# EAGLE design interface (EAGLE 9.6.2)
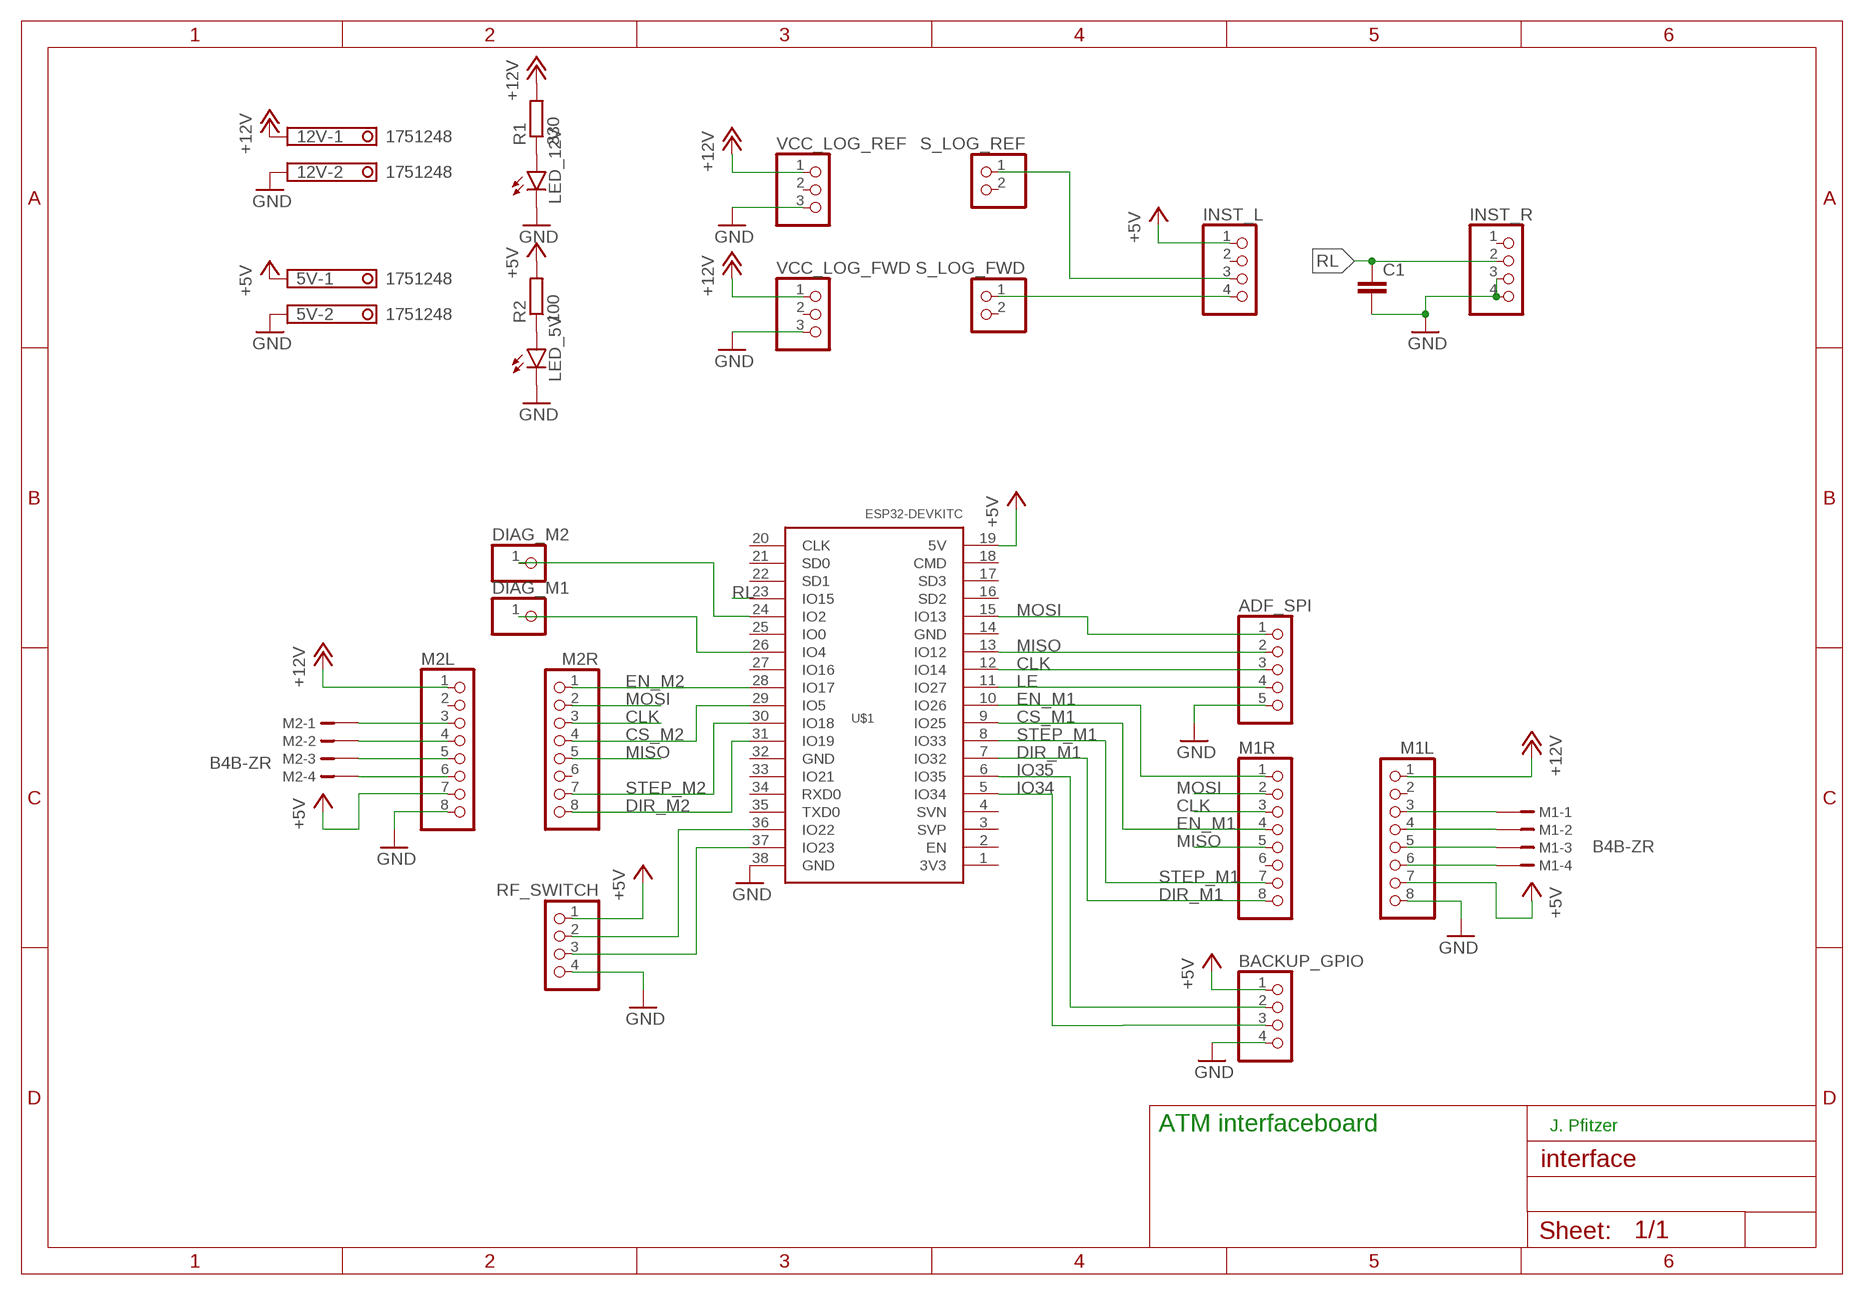
[diagram p0: schematic, sheet 1]

## Parts
5V  1751248  [1751248]
12V  1751248  [1751248]
ADF_SPI  PINHD-1X5  [1X05]
BACKUP_GPIO  PINHD-1X4  [1X04]
C1  C-EU025-025X050  [C025-025X050]
DIAG_M1  PINHD-1X1  [1X01]
DIAG_M2  PINHD-1X1  [1X01]
INST_L  PINHD-1X4  [1X04]
INST_R  PINHD-1X4  [1X04]
LED_5V  LED5MM  [LED5MM]
LED_12V  LED5MM  [LED5MM]
M1  B4B-ZR  [B4B-ZR]
M1L  PINHD-1X8  [1X08]
M1R  PINHD-1X8  [1X08]
M2  B4B-ZR  [B4B-ZR]
M2L  PINHD-1X8  [1X08]
M2R  PINHD-1X8  [1X08]
R1  330  R-EU_0207/12  [0207/12]
R2  100  R-EU_0207/12  [0207/12]
RF_SWITCH  PINHD-1X4  [1X04]
S_LOG_FWD  PINHD-1X2  [1X02]
S_LOG_REF  PINHD-1X2  [1X02]
U$1  ESP32DEVKITC  [ESP32-DEVKITC]
VCC_LOG_FWD  PINHD-1X3  [1X03]
VCC_LOG_REF  PINHD-1X3  [1X03]

## Nets
+5V: 5V.1 BACKUP_GPIO.1 INST_L.1 M1L.7 M2L.7 R2.2 RF_SWITCH.1 U$1.19(5V)
+12V: 12V.1 M1L.1 M2L.1 R1.2 VCC_LOG_FWD.1 VCC_LOG_REF.1
CLK: ADF_SPI.3 M1R.3 M2R.3 U$1.12(IO14)
CS_M1: M1R.4 U$1.9(IO25)
CS_M2: M2R.4 U$1.29(IO5)
DIR_M1: M1R.8 U$1.7(IO32)
DIR_M2: M2R.8 U$1.31(IO19)
EN_M1: M1R.1 U$1.10(IO26)
EN_M2: M2R.1 U$1.28(IO17)
GND: 5V.2 12V.2 ADF_SPI.5 BACKUP_GPIO.4 C1.2 INST_R.3 INST_R.4 LED_5V.K(C) LED_12V.K(C) M1L.8 M2L.8 RF_SWITCH.4 U$1.38(GND) VCC_LOG_FWD.3 VCC_LOG_REF.3
IO34: BACKUP_GPIO.3 U$1.5(IO34)
IO35: BACKUP_GPIO.2 U$1.6(IO35)
LE: ADF_SPI.4 U$1.11(IO27)
MISO: ADF_SPI.2 M1R.5 M2R.5 U$1.13(IO12)
MOSI: ADF_SPI.1 M1R.2 M2R.2 U$1.15(IO13)
N$1: M1.1 M1L.3
N$2: M1.2 M1L.4
N$3: M1.3 M1L.5
N$4: M1.4 M1L.6
N$5: M2.1 M2L.3
N$6: M2.2 M2L.4
N$7: M2.3 M2L.5
N$8: M2.4 M2L.6
N$9: DIAG_M1.1 U$1.26(IO4)
N$11: DIAG_M2.1 U$1.24(IO2)
N$12: INST_L.3 S_LOG_REF.1
N$13: INST_L.4 S_LOG_FWD.1
N$14: RF_SWITCH.2 U$1.36(IO22)
N$15: RF_SWITCH.3 U$1.37(IO23)
N$16: LED_12V.A R1.1
N$17: LED_5V.A R2.1
RL: C1.1 INST_R.2 U$1.23(IO15)
STEP_M1: M1R.7 U$1.8(IO33)
STEP_M2: M2R.7 U$1.30(IO18)
Unconnected: INST_L.2 INST_R.1 M1L.2 M1R.6 M2L.2 M2R.6 S_LOG_FWD.2 S_LOG_REF.2 U$1.1(3V3) U$1.2(EN) U$1.3(SVP) U$1.4(SVN) U$1.14(GND) U$1.16(SD2) U$1.17(SD3) U$1.18(CMD) U$1.20(CLK) U$1.21(SD0) U$1.22(SD1) U$1.25(IO0) U$1.27(IO16) U$1.32(GND) U$1.33(IO21) U$1.34(RXD0) U$1.35(TXD0) VCC_LOG_FWD.2 VCC_LOG_REF.2

## Notes on the sheet
- ATM interfaceboard | J. Pfitzer

## Library data of the parts
5V 12V = con-phoenix-350:1751248: MKDS 1/ 2-3,5 Printklemme Nennstrom: 10 A Bemessungsspannung: 160 V Raster: 3,5 mm Polzahl: 2 Montageart: Löten Anschlussart: Schraubanschluss Anschlussrichtung vom Leiter zur Platine: 0° Source: http://eshop.phoenixcontact.com .. 1751248.pdf; OC_FARNELL: unknown; OC_NEWARK: unknown
ADF_SPI = pinhead:PINHD-1X5: PIN HEADER
BACKUP_GPIO INST_L INST_R RF_SWITCH = pinhead:PINHD-1X4: PIN HEADER
C1 = rcl:C-EU: CAPACITOR, European symbol; SPICEPREFIX: C
DIAG_M1 DIAG_M2 = pinhead:PINHD-1X1: PIN HEADER
LED_5V LED_12V = led:LED: LED OSRAM: - CHIPLED LG R971, LG N971, LY N971, LG Q971, LY Q971, LO R971, LY R971 LH N974, LH R974 LS Q976, LO Q976, LY Q976 LO Q996 - Hyper CHIPLED LW Q18S LB Q993, LB Q99A, LB R99A - SideLED LS A670, LO A670, LY A670, LG A670, LP A670 LB A673, LV A673, LT A673, LW A673 LH A674 LY A675 LS A676, LA A676, LO A676, LY A676, LW A676 LS A679, LY A679, LG A679 - Hyper Micro SIDELED® LS Y876, LA Y876, LO Y876, LY Y876 LT Y87S - SmartLED LW L88C, LW L88S LB L89C, LB L89S, LG L890 LS L89K, LO L89K, LY L89K LS L896, LA L896, LO L896, LY L896 - TOPLED LS T670, LO T670, LY T670, LG T670, LP T670 LSG T670, LSP T670, LSY T670, LOP T670, LYG T670 LG T671, LOG T671, LSG T671 LB T673, LV T673, LT T673, LW T673 LH T674 LS T676, LA T676, LO T676, LY T676, LB T676, LH T676, LSB T676, LW T676 LB T67C, LV T67C, LT T67C, LS T67K, LO T67K, LY T67K, LW E67C LS E67B, LA E67B, LO E67B, LY E67B, LB E67C, LV E67C, LT E67C LW T67C LS T679, LY T679, LG T679 LS T770, LO T770, LY T770, LG T770, LP T770 LB T773, LV T773, LT T773, LW T773 LH T774 LS E675, LA E675, LY E675, LS T675 LS T776, LA T776, LO T776, LY T776, LB T776 LHGB T686 LT T68C, LB T68C - Hyper Mini TOPLED® LB M676 - Mini TOPLED Santana® LG M470 LS M47K, LO M47K, LY M47K Source: http://www.osram.convergy.de LUXEON: - LUMILED® LXK2-PW12-R00, LXK2-PW12-S00, LXK2-PW14-U00, LXK2-PW14-V00 LXK2-PM12-R00, LXK2-PM12-S00, LXK2-PM14-U00 LXK2-PE12-Q00, LXK2-PE12-R00, LXK2-PE12-S00, LXK2-PE14-T00, LXK2-PE14-U00 LXK2-PB12-K00, LXK2-PB12-L00, LXK2-PB12-M00, LXK2-PB14-N00, LXK2-PB14-P00, LXK2-PB14-Q00 LXK2-PR12-L00, LXK2-PR12-M00, LXK2-PR14-Q00, LXK2-PR14-R00 LXK2-PD12-Q00, LXK2-PD12-R00, LXK2-PD12-S00 LXK2-PH12-R00, LXK2-PH12-S00 LXK2-PL12-P00, LXK2-PL12-Q00, LXK2-PL12-R00 Source: www.luxeon.com KINGBRIGHT: KA-3528ASYC Source: www.kingbright.com
M1 M2 = con-jst:?4B-ZR: ZH CONNECTOR 1.5 mm, 4 pin 1 row Source: http://www.jst.com .. eZH.pdf; MF: FARNELL; MPN: B4B-ZR(LF)(SN); OC_FARNELL: 1830916; OC_NEWARK: 37K9960
M1L M1R M2L M2R = pinhead:PINHD-1X8: PIN HEADER
R1 R2 = rcl:R-EU_: RESISTOR, European symbol; SPICEPREFIX: R
S_LOG_FWD S_LOG_REF = pinhead:PINHD-1X2: PIN HEADER
U$1 = ESP32-DEVKITC:ESP32DEVKITC
VCC_LOG_FWD VCC_LOG_REF = pinhead:PINHD-1X3: PIN HEADER

## Board
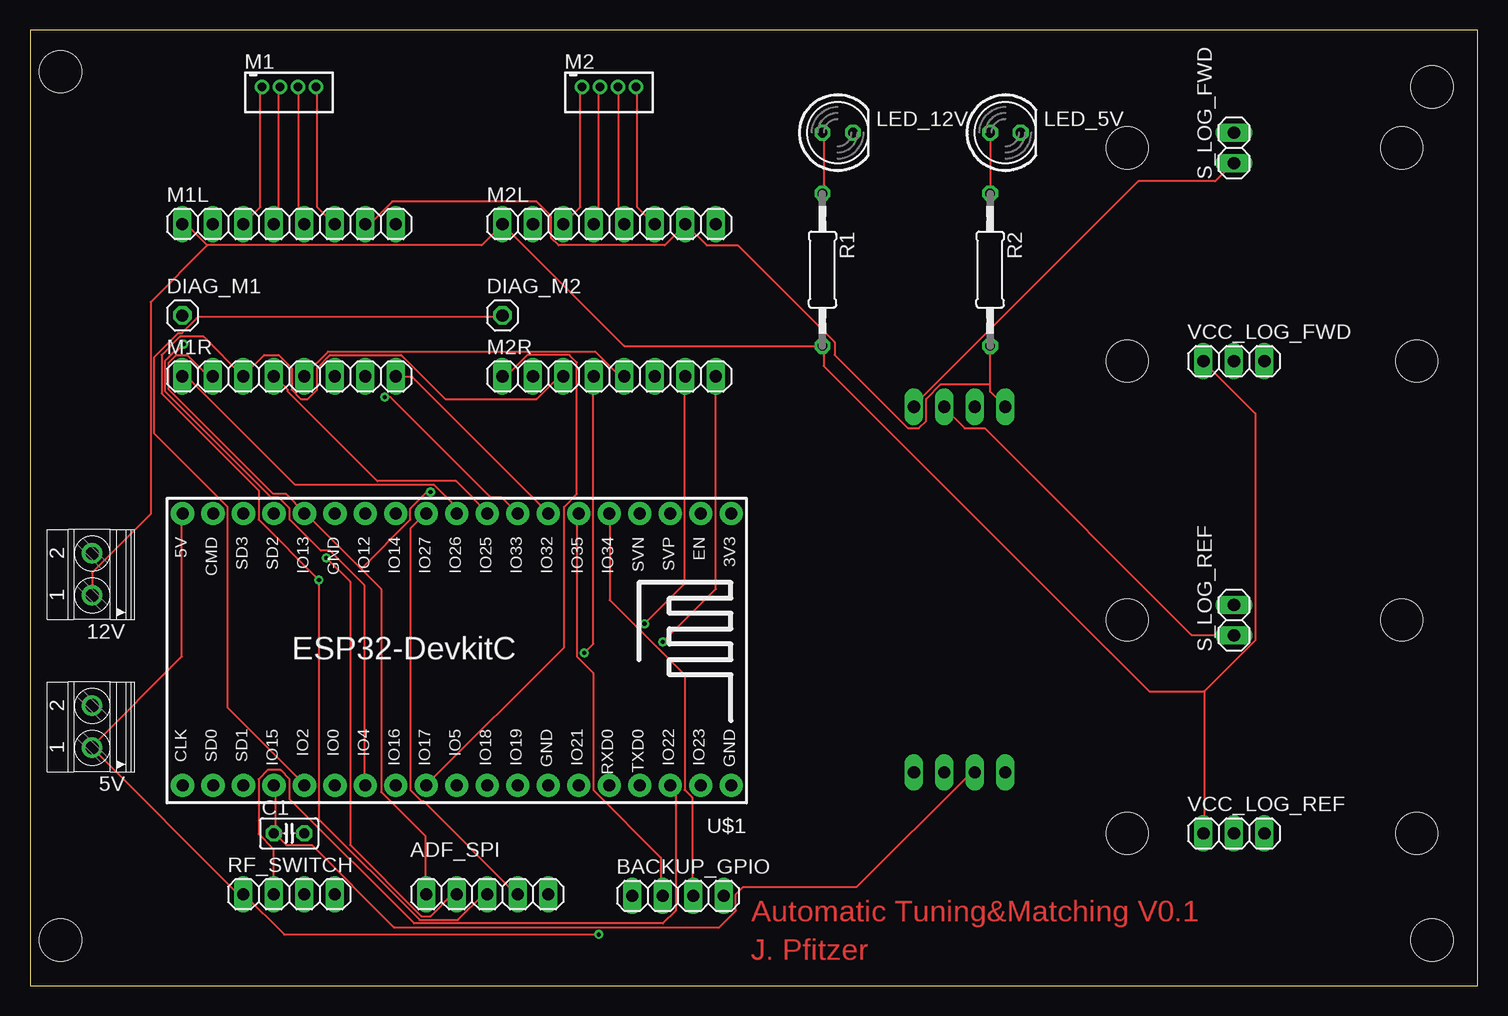
[diagram p1: board, top side]
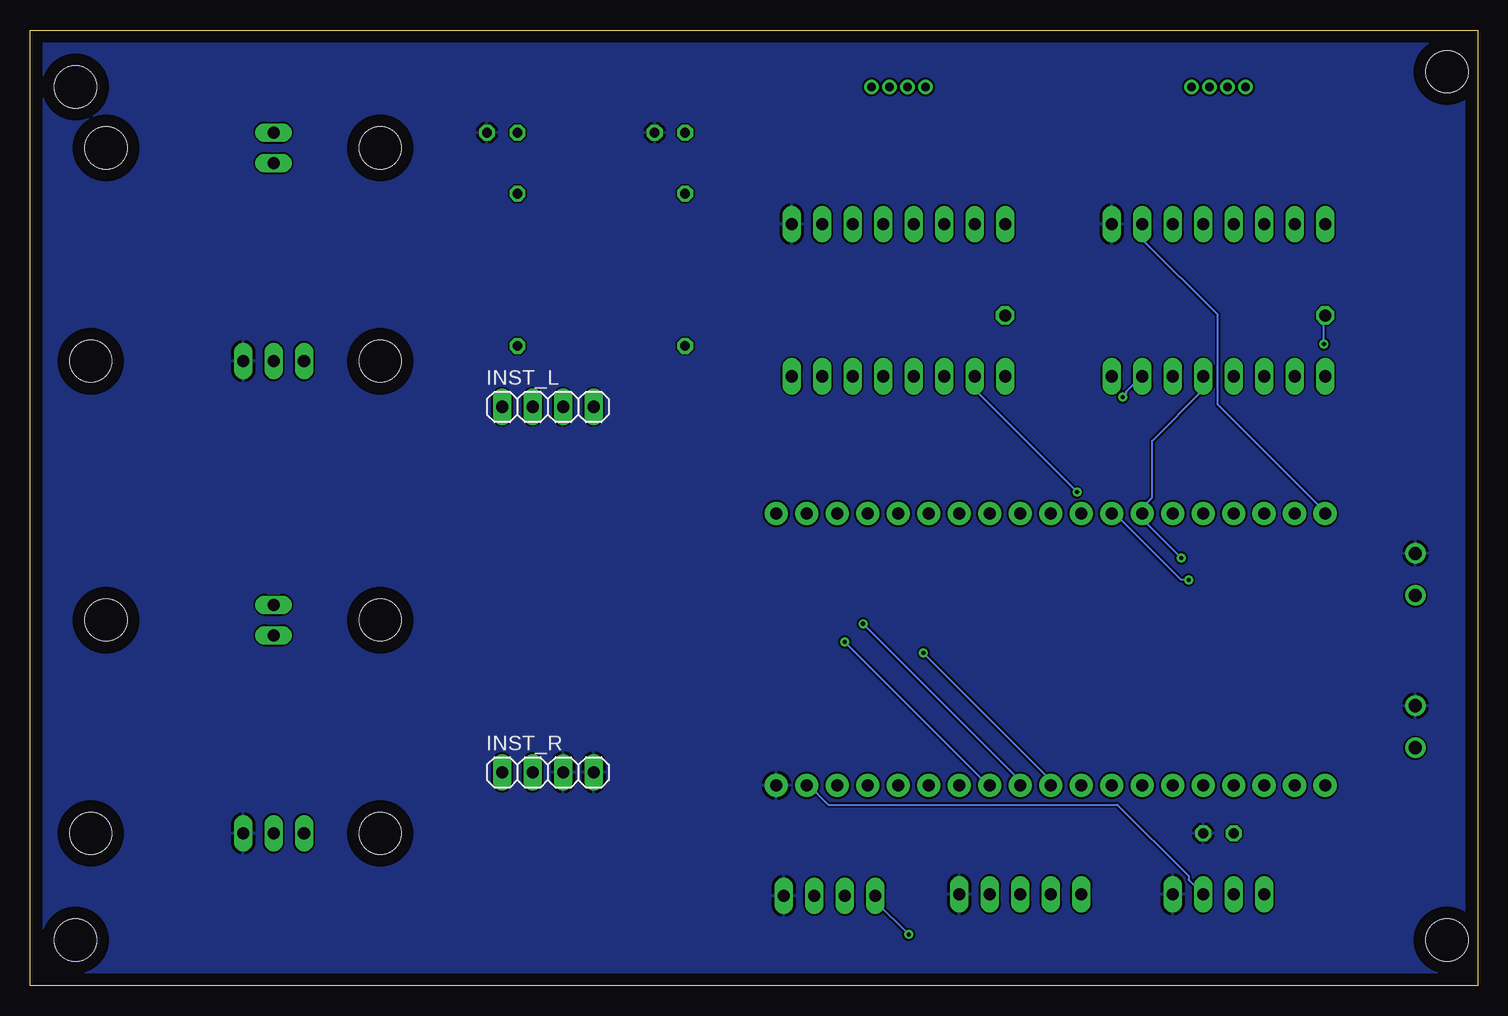
[diagram p2: board, bottom side, seen from below]

Size 120.63 x 79.68 mm. Coordinates in mm from the lower left corner, seen from the top.
Outline: 0,0 120.63,0 120.63,79.68 0,79.68 0,0
Copper layers (1*16): Top 0.035mm / dielectric 1.5mm / Bottom 0.035mm
Design rules "default": minimum track width 6mil, minimum drill 0.35mm, track to track 6mil, track to pad 6mil, pad to pad 6mil, via to via 6mil, smd to smd 6mil, copper to edge 40mil, drill to drill 6mil, minimum pad ring 10mil, minimum via ring 8mil, stop-mask expansion 4mil, vias tented up to drill 0mil, thermal gap 10mil
Holes 3.5 mm at 91.44,52.07 91.44,69.85 115.57,52.07 114.3,69.85 91.44,12.7 115.57,12.7 91.44,30.48 114.3,30.48 2.54,76.2 2.54,3.81 116.84,3.81 116.84,74.93

### Footprints (pad centres in the part's own frame; a part is rotated, then mirrored left to right if it is on the bottom)
1751248 = drill 1.1 pad 1.7: 1 -1.75,-0.1; 2 1.75,-0.1
1X05 = drill 1.016 long: 1 -5.08,0; 2 -2.54,0; 3 0,0; 4 2.54,0; 5 5.08,0
1X04 = drill 1.016 long: 1 -3.81,0; 2 -1.27,0; 3 1.27,0; 4 3.81,0
C025-025X050 = drill 0.813 octagon: 1 -1.27,0; 2 1.27,0
1X01 = drill 1.016 octagon: 1 0,0
LED5MM = drill 0.813 octagon: A -1.27,0; K 1.27,0
B4B-ZR = drill 0.7 pad 1.1: 1 -2.25,0; 2 -0.75,0; 3 0.75,0; 4 2.25,0
1X08 = drill 1.016 long: 1 -8.89,0; 2 -6.35,0; 3 -3.81,0; 4 -1.27,0; 5 1.27,0; 6 3.81,0; 7 6.35,0; 8 8.89,0
0207/12 = drill 0.813 octagon: 1 -6.35,0; 2 6.35,0
1X02 = drill 1.016 long: 1 -1.27,0; 2 1.27,0
ESP32-DEVKITC = drill 1 pad 1.93: 1 -22.87,-11.42; 2 -20.33,-11.42; 3 -17.79,-11.42; 4 -15.25,-11.42; 5 -12.71,-11.42; 6 -10.17,-11.42; 7 -7.63,-11.42; 8 -5.09,-11.42; 9 -2.55,-11.42; 10 -0.01,-11.42; 11 2.53,-11.42; 12 5.07,-11.42; 13 7.61,-11.42; 14 10.15,-11.42; 15 12.69,-11.42; 16 15.23,-11.42; 17 17.77,-11.42; 18 20.31,-11.42; 19 22.85,-11.42; 20 22.85,11.23; 21 20.31,11.23; 22 17.77,11.23; 23 15.23,11.23; 24 12.69,11.23; 25 10.15,11.23; 26 7.61,11.23; 27 5.07,11.23; 28 2.53,11.23; 29 -0.01,11.23; 30 -2.55,11.23; 31 -5.09,11.23; 32 -7.63,11.23; 33 -10.17,11.23; 34 -12.71,11.23; 35 -15.25,11.23; 36 -17.79,11.23; 37 -20.33,11.23; 38 -22.87,11.23
1X03 = drill 1.016 long: 1 -2.54,0; 2 0,0; 3 2.54,0

### Placement (x,y rotation side)
5V  5.08,21.59 90 top
12V  5.08,34.29 90 top
ADF_SPI  38.1,7.62 0 top
BACKUP_GPIO  54,7.48 0 top
C1  21.59,12.7 0 top
DIAG_M1  12.7,55.88 0 top
DIAG_M2  39.37,55.88 0 top
INST_L  77.47,48.26 0 bottom
INST_R  77.47,17.78 0 bottom
LED_5V  81.28,71.12 0 top
LED_12V  67.31,71.12 0 top
M1  21.59,74.93 0 top
M1L  21.59,63.5 0 top
M1R  21.59,50.8 0 top
M2  48.26,74.93 0 top
M2L  48.26,63.5 0 top
M2R  48.26,50.8 0 top
R1  66.04,59.69 270 top
R2  80.01,59.69 270 top
RF_SWITCH  21.59,7.62 0 top
S_LOG_FWD  100.33,69.85 90 top
S_LOG_REF  100.33,30.48 90 top
U$1  35.56,27.94 180 top
VCC_LOG_FWD  100.33,52.07 0 top
VCC_LOG_REF  100.33,12.7 0 top

### Tracks (layer width: path | path; a pad name or v marks a point on that pad's centre or on a via)
+5V  (via drill 0.35)
  Top 0.152: 80.01,50.14 80.01,49.53 INST_L.1 | 80.01,50.14 R2.2 | M1L.7 28.04,63.55 28.35,63.55 30.18,65.38 42.22,65.38 43.43,64.16 43.43,62.33 44.04,61.72 52.88,61.72 54.56,63.4 M2L.7 56.39,61.72 58.98,61.72 67.06,53.65 67.06,52.58 73.15,46.48 74.07,46.48 74.68,47.09 74.68,48.92 75.89,50.14 80.01,50.14 | v47.4,4.27 21.18,4.27 17.83,7.62 RF_SWITCH.1 17.37,7.62 5.18,19.81 5V.1 5.18,19.96 12.65,27.43 12.65,39.32 U$1.19
  Bottom 0.152: v47.4,4.27 50.14,7.01 50.14,7.47 BACKUP_GPIO.1 | M1L.7 27.89,63.4 27.89,62.18 21.64,55.93 21.64,48.46 12.65,39.47 U$1.19
+12V
  Top 0.152: 97.84,24.54 97.84,12.8 VCC_LOG_REF.1 | 97.84,24.54 102.11,28.8 102.11,47.7 97.84,51.97 VCC_LOG_FWD.1 | 14.78,61.72 13.11,63.4 12.8,63.4 M1L.1 | 14.78,61.72 37.64,61.72 39.32,63.4 M2L.1 49.53,53.34 R1.2 66.14,53.34 66.14,51.66 93.27,24.54 97.84,24.54 | 14.78,61.72 10.06,57 10.06,39.32 5.18,34.44 5.18,32.61 12V.1
CLK  (via drill 0.35)
  Top 0.152: ADF_SPI.3 37.8,7.62 35.66,5.49 32.46,5.49 24.08,13.87 v24.08,33.83 19.05,38.86 19.05,41.3 10.97,49.38 10.97,52.58 12.5,54.1 14.48,54.1 M1R.3 17.83,50.9 19.51,52.58 20.73,52.58 21.79,51.51 21.79,49.68 22.55,48.92 23.16,48.92 23.93,49.68 23.93,51.51 24.99,52.58 30.94,52.58 34.59,48.92 42.22,48.92 44.04,50.75 44.35,50.75 M2R.3
  Bottom 0.152: v24.08,33.83 24.69,33.83 30.18,39.32 30.48,39.32 U$1.12
CS_M1
  Top 0.152: M1R.4 20.42,50.75 21.49,49.68 21.49,49.53 28.96,42.06 35.51,42.06 38.1,39.47 U$1.9
CS_M2  (via drill 0.35)
  Top 0.152: v46.18,27.74 46.94,28.5 46.94,50.75 M2R.4
  Bottom 0.152: v46.18,27.74 35.66,17.22 35.66,16.76 U$1.29
DIR_M1
  Top 0.152: M1R.8 30.48,50.75 31.85,50.75 43.13,39.47 U$1.7
DIR_M2  (via drill 0.35)
  Top 0.152: M2R.8 57.15,33.07 v52.73,28.65
  Bottom 0.152: v52.73,28.65 40.69,16.61 U$1.31
EN_M1
  Top 0.152: M1R.1 12.8,50.75 13.11,50.75 22.1,41.76 33.68,41.76 35.51,39.93 35.51,39.47 U$1.10
EN_M2
  Top 0.152: M2R.1 39.47,50.9 39.78,50.9 41.45,52.58 44.96,52.58 45.57,51.97 45.57,41 44.5,39.93 44.5,28.19 33.07,16.76 U$1.28
GND
  pour Bottom (isolate 0.152): 0,79.68 120.64,79.68 120.64,0 0,0
IO34
  Top 0.152: BACKUP_GPIO.3 55.17,7.62 55.17,15.7 54.56,16.31 54.56,25.91 48.31,32.16 48.31,39.32 U$1.5
IO35
  Top 0.152: BACKUP_GPIO.2 52.58,7.62 52.58,10.67 46.94,16.31 46.94,26.06 45.57,27.43 45.57,39.17 45.72,39.32 U$1.6
LE
  Top 0.152: ADF_SPI.4 40.54,7.62 32.77,15.39 32.61,15.39 31.7,16.31 31.7,38.1 32.92,39.32 U$1.11
MISO  (via drill 0.35)
  Top 0.152: ADF_SPI.2 35.2,7.62 33.38,5.79 32.61,5.79 26.67,11.73 26.67,33.68 v24.69,35.66 | M2R.5 49.53,50.9 49.07,50.9 47.09,52.88 24.84,52.88 22.86,50.9 M1R.5
  Bottom 0.152: v24.69,35.66 27.89,38.86 27.89,39.32 U$1.13 27.89,39.47 27.89,39.93 27.13,40.69 27.13,45.41 22.86,49.68 M1R.5
MOSI  (via drill 0.35)
  Top 0.152: M1R.2 15.24,50.9 14.78,50.9 13.11,52.58 12.19,52.58 11.58,51.97 11.58,49.68 20.27,41 21.34,41 22.86,39.47 U$1.15 23.01,39.32 27.58,34.75 | 27.58,34.75 29.26,33.07 29.26,16.15 32.92,12.5 32.92,7.62 ADF_SPI.1 | v33.38,41.15 33.07,41.15 31.7,39.78 31.7,38.86 27.58,34.75
  Bottom 0.152: M2R.2 41.91,49.68 v33.38,41.15
N$1
  Top 0.152: M1L.3 19.2,64.92 19.2,74.83 M1.1
N$2
  Top 0.152: M1.2 20.73,74.83 20.73,63.86 20.42,63.55 M1L.4
N$3
  Top 0.152: M1.3 22.4,74.83 22.4,64.01 22.86,63.55 M1L.5
N$4
  Top 0.152: M1.4 23.93,74.83 23.93,64.92 25.3,63.55 M1L.6
N$5
  Top 0.152: M2L.3 45.87,64.92 45.87,74.83 M2.1
N$6
  Top 0.152: M2.2 47.4,74.83 47.4,63.86 47.09,63.55 M2L.4
N$7
  Top 0.152: M2.3 49.07,74.83 49.07,64.01 49.53,63.55 M2L.5
N$8
  Top 0.152: M2.4 50.6,74.83 50.6,64.92 51.97,63.55 M2L.6
N$9  (via drill 0.35)
  Top 0.152: v12.8,53.49 12.19,52.88 12.04,52.88 11.28,52.12 11.28,49.53 20.12,40.69 20.73,40.69 21.64,39.78 21.64,38.86 24.23,36.27 24.99,36.27 27.89,33.38 27.89,16.76 U$1.26
  Bottom 0.152: v12.8,53.49 12.8,55.78 DIAG_M1.1
N$11
  Top 0.152: DIAG_M2.1 39.32,55.78 14.02,55.78 12.65,54.41 12.34,54.41 10.36,52.43 10.36,46.02 16.46,39.93 16.46,23.16 22.86,16.76 U$1.24
N$12
  Top 0.152: S_LOG_REF.1 100.28,29.26 96.77,29.26 79.55,46.48 77.88,46.48 76.2,48.16 INST_L.3
N$13
  Top 0.152: INST_L.4 73.76,48.31 74.37,48.92 74.37,49.07 92.35,67.06 98.75,67.06 100.28,68.58 S_LOG_FWD.1
N$14
  Top 0.152: RF_SWITCH.2 20.27,7.62 20.27,11.43 19.05,12.65 19.05,17.22 19.81,17.98 20.88,17.98 21.64,17.22 21.64,15.54 32,5.18 52.73,5.18 53.8,6.25 53.8,16.31 53.49,16.61 U$1.36
N$15
  Bottom 0.152: RF_SWITCH.3 24.08,8.84 24.08,9.14 30.02,15.09 54.1,15.09 55.78,16.76 U$1.37
N$16
  Top 0.152: R1.1 66.14,66.14 66.14,71.02 LED_12V.A
N$17
  Top 0.152: LED_5V.A R2.1
RL
  Top 0.152: U$1.23 20.42,16.61 20.42,12.8 C1.1 20.42,12.65 21.34,11.73 23.47,11.73 30.33,4.88 57.45,4.88 58.83,6.25 58.83,7.62 59.44,8.23 68.89,8.23 78.33,17.68 78.64,17.68 INST_R.2
STEP_M1  (via drill 0.35)
  Top 0.152: v29.57,49.07 30.02,49.07 38.41,40.69 39.32,40.69 U$1.8
  Bottom 0.152: v29.57,49.07 29.26,49.38 29.26,49.53 28.04,50.75 M1R.7
STEP_M2  (via drill 0.35)
  Top 0.152: v51.21,30.18 54.56,33.53 54.56,50.75 M2R.7
  Bottom 0.152: v51.21,30.18 38.25,17.22 38.25,16.76 U$1.30

### Text on the board
Top: Automatic Tuning&Matching V0.1 | J. Pfitzer